# EAGLE design Hall Effect Arduino (EAGLE 7.1.0)
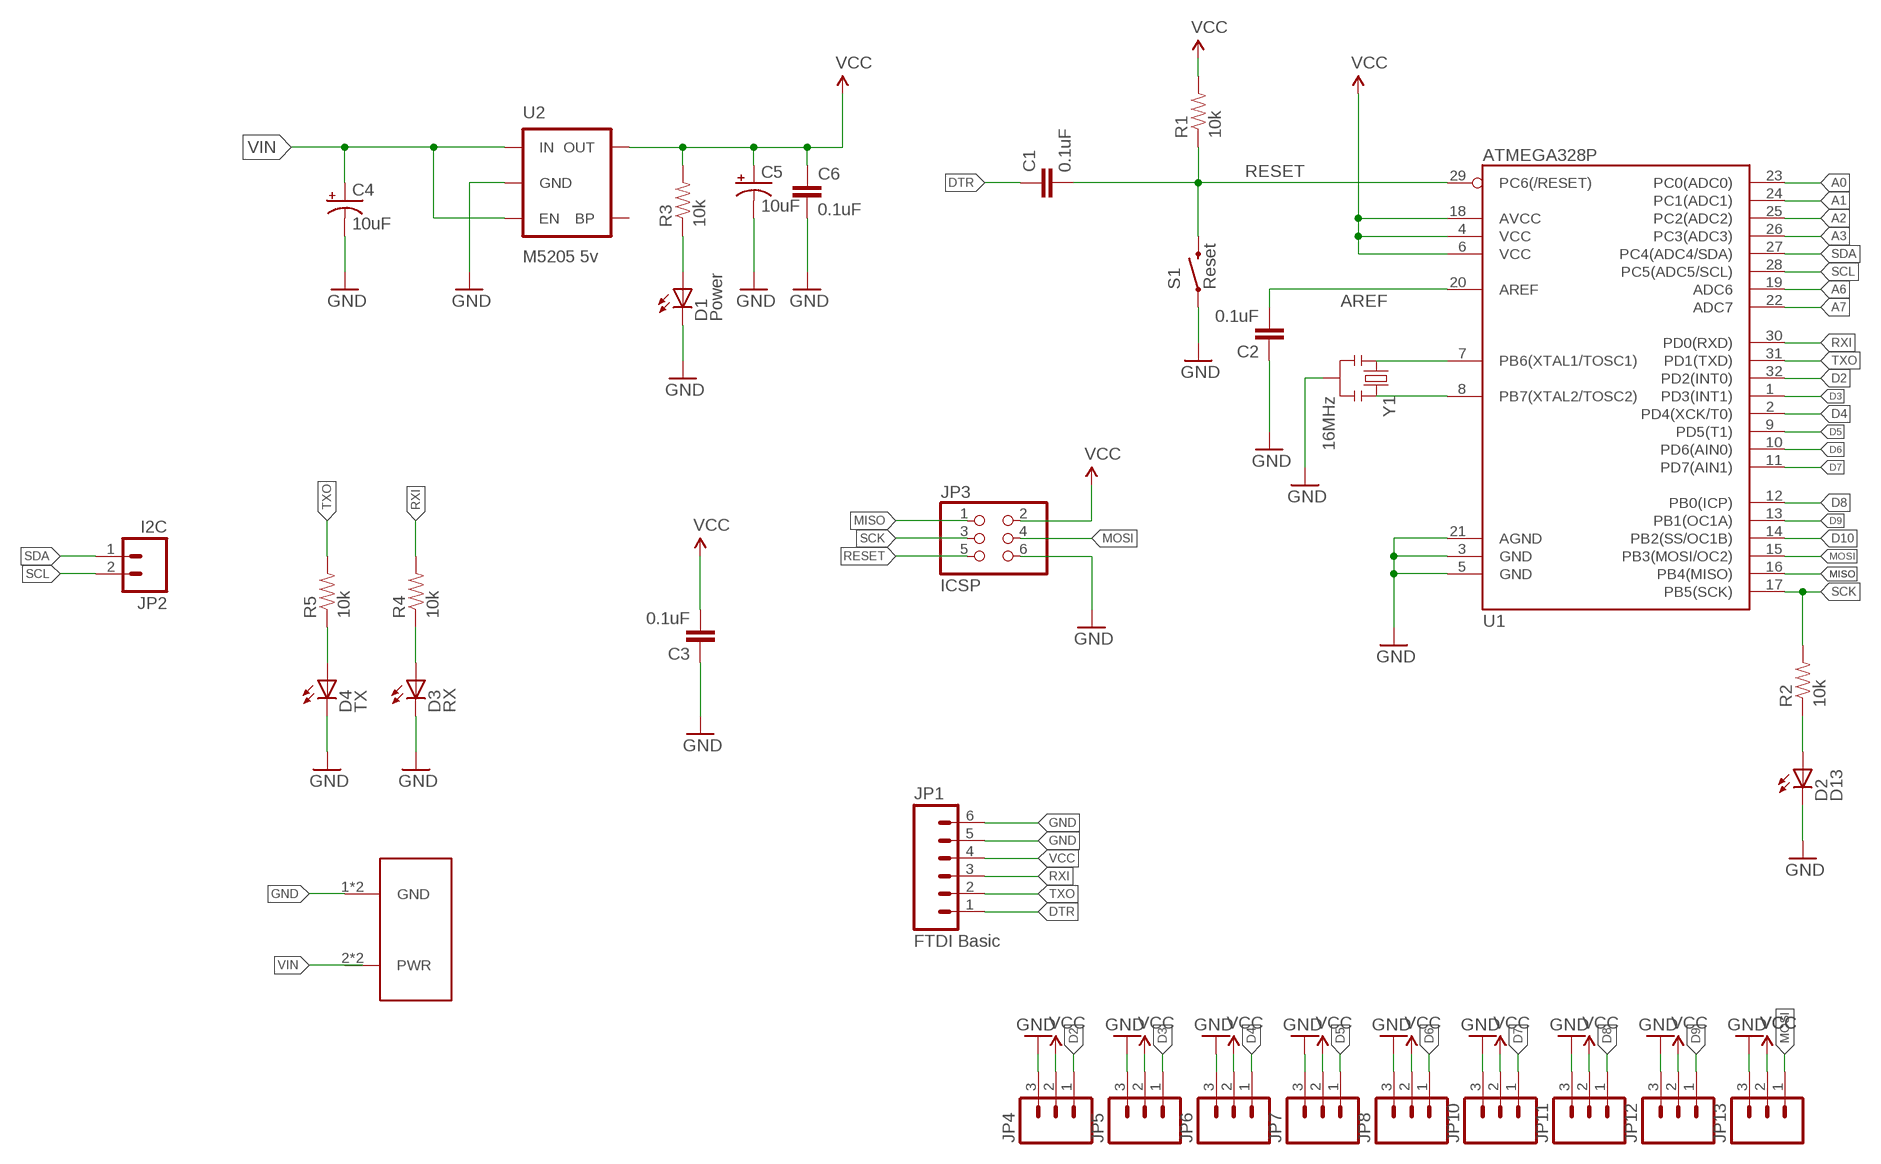
[diagram p0: schematic, sheet 1]

## Parts
C1  0.1uF  CAP0603-CAP  [0603-CAP]
C2  0.1uF  CAP0603-CAP  [0603-CAP]
C3  0.1uF  CAP0603-CAP  [0603-CAP]
C4  10uF  CAP_POL1206  [EIA3216]
C5  10uF  CAP_POL1206  [EIA3216]
C6  0.1uF  CAP0603-CAP  [0603-CAP]
D1  Power  LED-RED0603  [LED-0603]
D2  D13  LED-RED0603  [LED-0603]
D3  RX  LED-GREEN0603  [LED-0603]
D4  TX  LED-RED0603  [LED-0603]
JP1  FTDI Basic  M06SIP  [1X06]
JP2  I2C  M02PTH  [1X02]
JP3  ICSP  PINHD-2X3  [2X03]
JP4  M03PTH  [1X03]
JP5  M03PTH  [1X03]
JP6  M03PTH  [1X03]
JP7  M03PTH  [1X03]
JP8  M03PTH  [1X03]
JP10  M03PTH  [1X03]
JP11  M03PTH  [1X03]
JP12  M03PTH  [1X03]
JP13  M03PTH  [1X03]
R1  10k  RESISTOR0603-RES  [0603-RES]
R2  10k  RESISTOR0603-RES  [0603-RES]
R3  10k  RESISTOR0603-RES  [0603-RES]
R4  10k  RESISTOR0603-RES  [0603-RES]
R5  10k  RESISTOR0603-RES  [0603-RES]
S1  Reset  SWITCH-MOMENTARY-2SMD  [TACTILE_SWITCH_SMD]
U1  ATMEGA328P  ATMEGA328_SMT  [TQFP32-08]
U2  M5205 5v  MIC52055V  [SOT23-5]
U$1  LSF-SMT  [LSF-SMT]
Y1  16MHz  RESONATOR16MHZ  [RESONATOR-SMD]

## Nets
A0: U1.23(PC0(ADC0))
A1: U1.24(PC1(ADC1))
A2: U1.25(PC2(ADC2))
A3: U1.26(PC3(ADC3))
A6: U1.19(ADC6)
A7: U1.22(ADC7)
AREF: C2.2 U1.20(AREF)
D2: JP4.1 U1.32(PD2(INT0))
D3: JP5.1 U1.1(PD3(INT1))
D4: JP6.1 U1.2(PD4(XCK/T0))
D5: JP7.1 U1.9(PD5(T1))
D6: JP8.1 U1.10(PD6(AIN0))
D7: JP10.1 U1.11(PD7(AIN1))
D8: JP11.1 U1.12(PB0(ICP))
D9: JP12.1 U1.13(PB1(OC1A))
D10: U1.14(PB2(SS/OC1B))
DTR: C1.1 JP1.1
GND: C2.1 C3.1 C4.C(-) C5.C(-) C6.2 D1.C D2.C D3.C D4.C JP1.5 JP1.6 JP3.6 JP4.3 JP5.3 JP6.3 JP7.3 JP8.3 JP10.3 JP11.3 JP12.3 JP13.3 S1.1 U1.3(GND) U1.5(GND) U1.21(AGND) U2.2(GND) U$1.1(GND) U$1.1-2(GND) Y1.2
MISO: JP3.1 U1.16(PB4(MISO))
MOSI: JP3.4 JP13.1 U1.15(PB3(MOSI/OC2))
N$1: U1.7(PB6(XTAL1/TOSC1)) Y1.1
N$2: U1.8(PB7(XTAL2/TOSC2)) Y1.3
N$3: D1.A R3.1
N$4: D2.A R2.1
N$5: D3.A R4.1
N$6: D4.A R5.1
RESET: C1.2 JP3.5 R1.1 S1.3 U1.29(PC6(/RESET))
RXI: JP1.3 R4.2 U1.30(PD0(RXD))
SCK: JP3.3 R2.2 U1.17(PB5(SCK))
SCL: JP2.2 U1.28(PC5(ADC5/SCL))
SDA: JP2.1 U1.27(PC4(ADC4/SDA))
TXO: JP1.2 R5.2 U1.31(PD1(TXD))
VCC: C3.2 C5.A(+) C6.1 JP1.4 JP3.2 JP4.2 JP5.2 JP6.2 JP7.2 JP8.2 JP10.2 JP11.2 JP12.2 JP13.2 R1.2 R3.2 U1.4(VCC) U1.6(VCC) U1.18(AVCC) U2.5(OUT)
VIN: C4.A(+) U2.1(IN) U2.3(EN)
Unconnected: U2.4(BP) U$1.2(PWR) U$1.2-2(PWR)

## Library data of the parts
C1-C3 C6 = SparkFun-Passives:CAP: Capacitor Standard 0603 ceramic capacitor, and 0.1" leaded capacitor.
C4 C5 = SparkFun-Passives:CAP_POL: Capacitor Polarized These are standard SMD and PTH capacitors. Normally 10uF, 47uF, and 100uF in electrolytic and tantalum varieties. Always verify the external diameter of the through hole cap, it varies with capacity, voltage, and manufacturer. The EIA devices should be standard.
D1 D2 D4 = SparkFun-LED:LED-RED: Assorted Red LEDs LilyPad 1206- DIO-09912 1206- DIO-00809 0603- DIO-00819; PROD_ID: DIO-00819; VALUE: RED
D3 = SparkFun-LED:LED-GREEN: Various green LEDs Green LEDs used in SFE Production 0603- DIO-00821 LARGE- DIO-00862 LILYPAD- DIO-09910; PROD_ID: DIO-00821; VALUE: GREEN
JP1 = SparkFun-Connectors:M06: Header 6 Standard 6-pin 0.1" header. Use with straight break away headers (SKU : PRT-00116), right angle break away headers (PRT-00553), swiss pins (PRT-00743), machine pins (PRT-00117), and female headers (PRT-00115). Molex polarized connector foot print use with SKU : PRT-08094 with associated crimp pins and housings. NOTES ON THE VARIANTS LOCK and LOCK_LONGPADS... This footprint was designed to help hold the alignment of a through-hole component (i.e. 6-pin header) while soldering it into place. You may notice that each hole has been shifted either up or down by 0.005 of an inch from it's more standard position (which is a perfectly straight line). This slight alteration caused the pins (the squares in the middle) to touch the edges of the holes. Because they are alternating, it causes a "brace" to hold the component in place. 0.005 has proven to be the perfect amount of "off-center" position when using our standard breakaway headers. Although looks a little odd when you look at the bare footprint, once you have a header in there, the alteration is very hard to notice. Also,if you push a header all the way into place, it is covered up entirely on the bottom side. This idea of altering the position of holes to aid alignment will be further integrated into the Sparkfun Library for other footprints. It can help hold any component with 3 or more connection pins.
JP2 = SparkFun-Connectors:M02: Standard 2-pin 0.1" header. Use with - straight break away headers ( PRT-00116) - right angle break away headers (PRT-00553) - swiss pins (PRT-00743) - machine pins (PRT-00117) - female headers (PRT-00115) Molex polarized connector foot print use with: PRT-08233 with associated crimp pins and housings. 2.54_SCREWTERM for use with PRT-10571. 3.5mm Screw Terminal footprints for PRT-08084 5mm Screw Terminal footprints for use with PRT-08433
JP3 = SparkFun-Connectors:PINHD-2X3: PIN HEADER
JP4-JP8 JP10-JP13 = SparkFun-Connectors:M03: Header 3 Standard 3-pin 0.1" header. Use with straight break away headers (SKU : PRT-00116), right angle break away headers (PRT-00553), swiss pins (PRT-00743), machine pins (PRT-00117), and female headers (PRT-00115). Molex polarized connector foot print use with SKU : PRT-08232 with associated crimp pins and housings.
R1-R5 = SparkFun-Passives:RESISTOR: Resistor Basic schematic elements and footprints for 0603, 1206, and PTH resistors.
S1 = SparkFun-Electromechanical:SWITCH-MOMENTARY-2: Various NO switches- pushbuttons, reed, etc; PROD_ID: SWCH-08247
U1 = SparkFun-DigitalIC:ATMEGA328_SMT: 32-Pin Atmega328 part Commonly used on Arduino compatible boards Available in QFP and QFN packages TQFP is IC-09069 QFN is non-stock; PROD_ID: IC-09069
U2 = SparkFun-PowerIC:MIC5205: MIC5205 150mA vreg 3.3V - VREG-00822 5V - VREG-00823; PROD_ID: VREG-00823
U$1 = LSF-SMT:LSF-SMT
Y1 = SparkFun-FreqCtrl:RESONATOR: Resonator Small SMD resonator. Used, eg, on the Arduino Pro/ Pro Mini boards. 8MHz- XTAL-08895 16MHz- XTAL-08900; PROD_ID: XTAL-08900

## Board
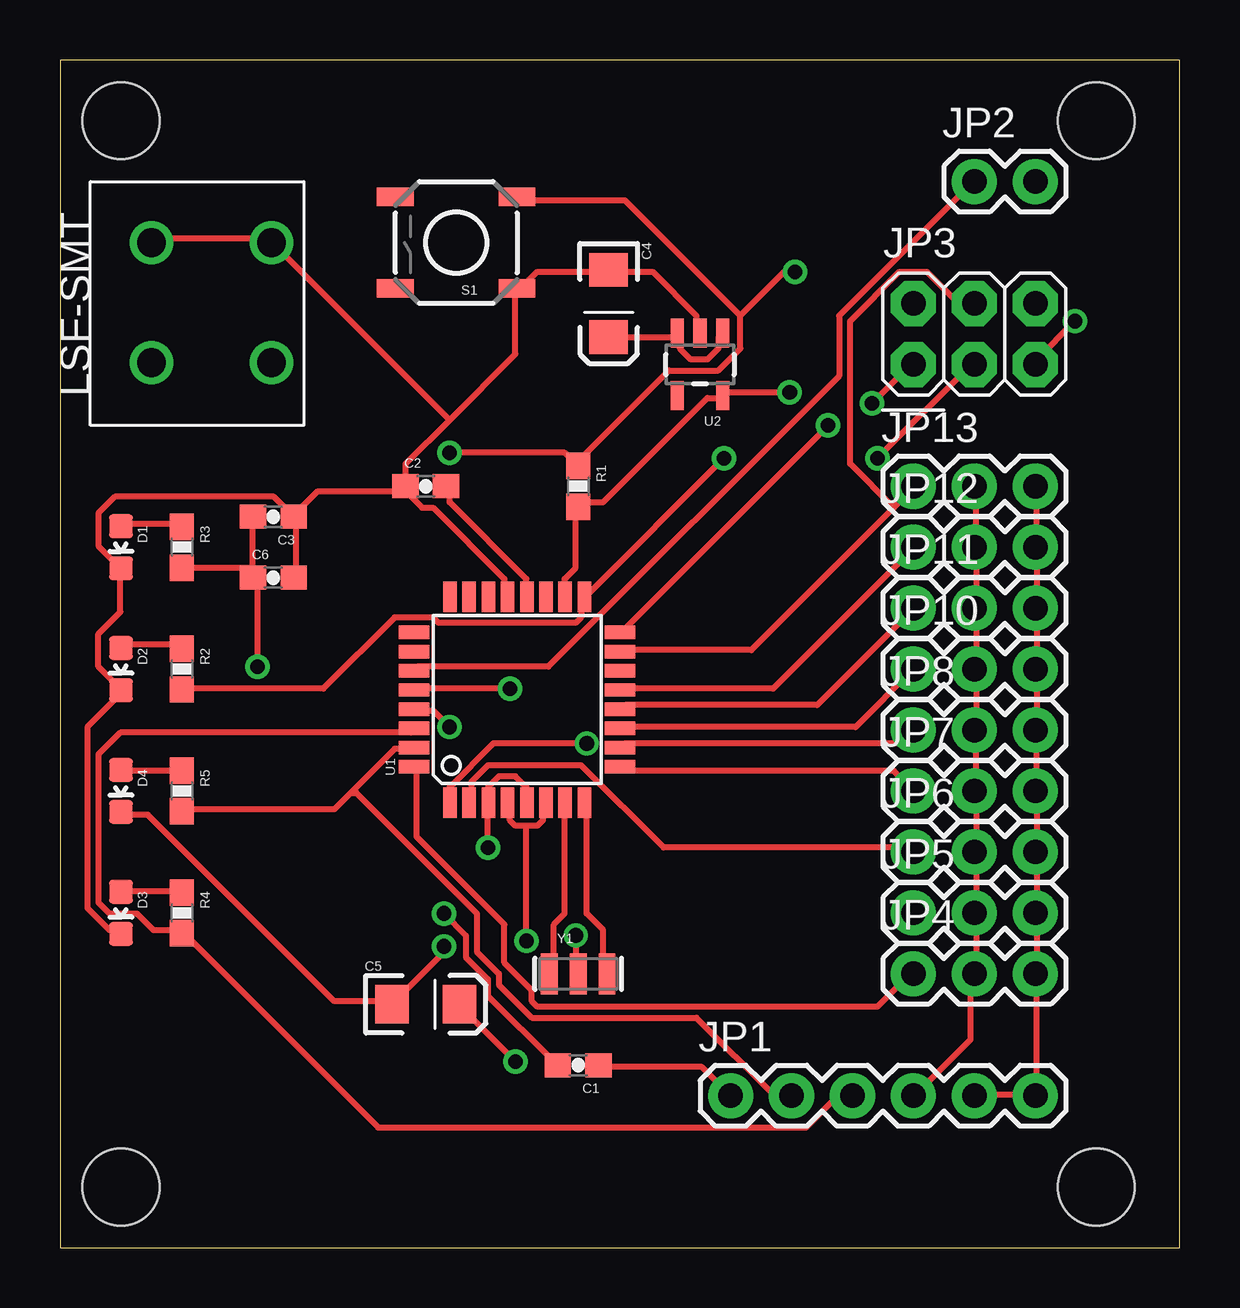
[diagram p1: board, top side]
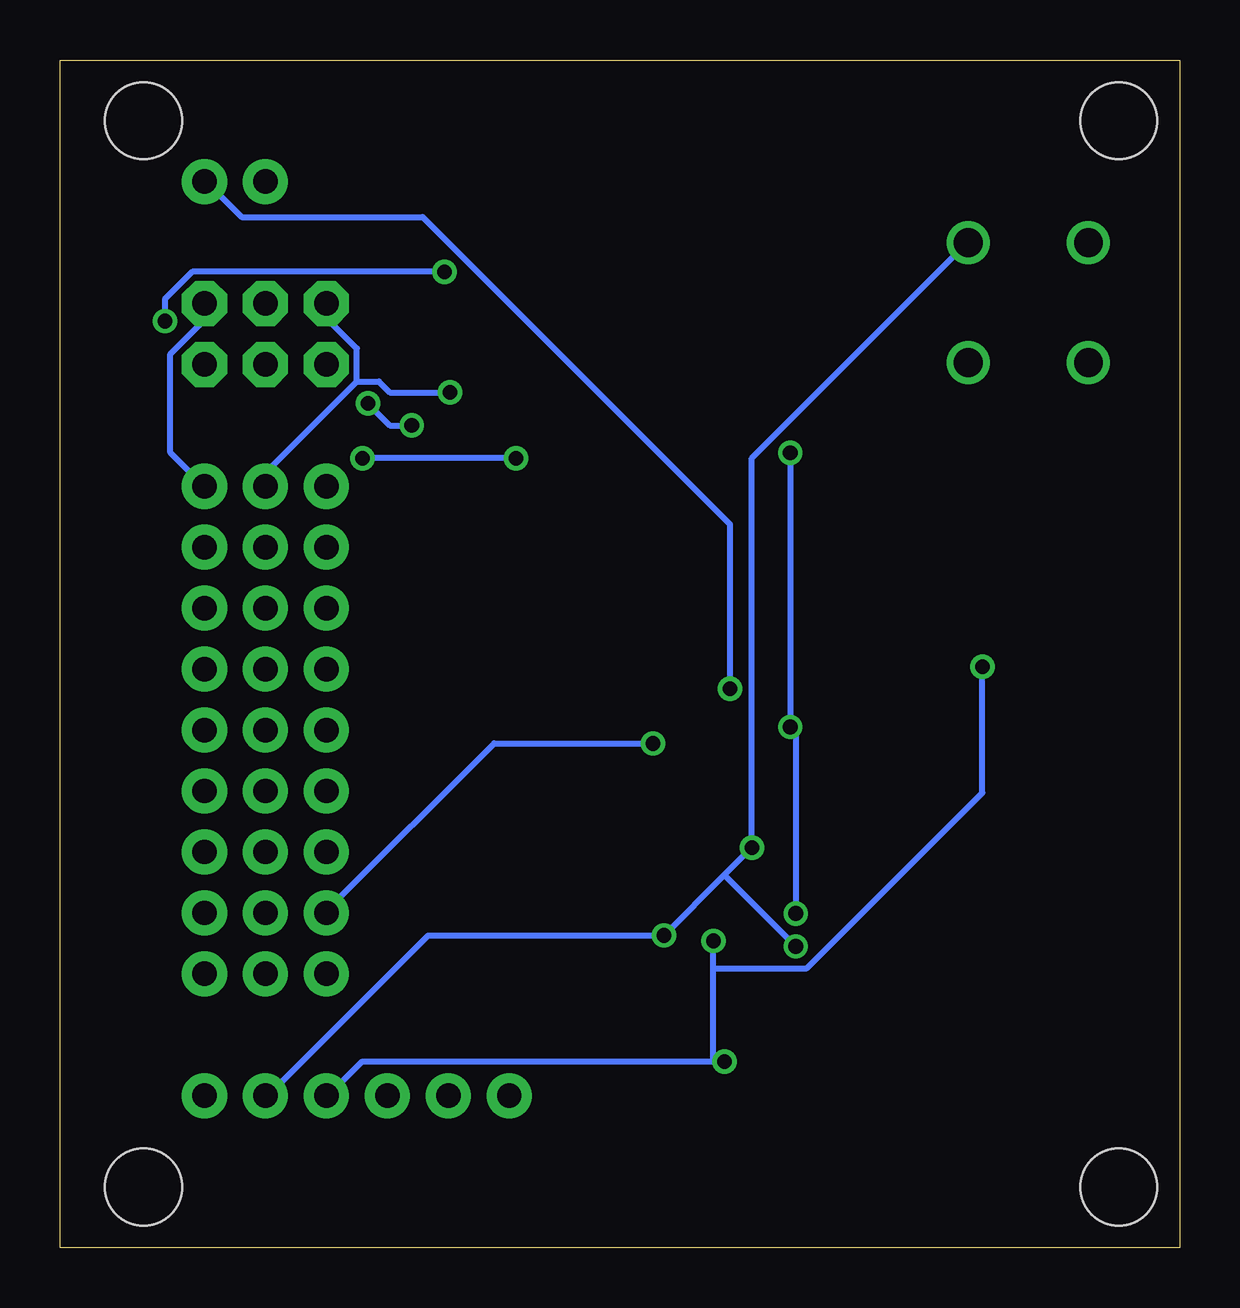
[diagram p2: board, bottom side, seen from below]

Size 46.66 x 49.52 mm. Coordinates in mm from the lower left corner, seen from the top.
Outline: 0,0 46.66,0 46.66,49.52 0,49.52 0,0
Copper layers (1*16): Top 0.035mm / dielectric 1.5mm / Bottom 0.035mm
Design rules "default": minimum track width 10mil, minimum drill 24mil, track to track 8mil, track to pad 8mil, pad to pad 8mil, via to via 8mil, smd to smd 8mil, copper to edge 40mil, drill to drill 8mil, minimum pad ring 10mil, minimum via ring 8mil, stop-mask expansion 4mil, vias tented up to drill 0mil, thermal gap 10mil
Holes 3.2 mm at 2.54,2.54 43.18,2.54 2.54,46.99 43.18,46.99

### Footprints (pad centres in the part's own frame; a part is rotated, then mirrored left to right if it is on the bottom)
0603-CAP = smd 1.1 x 1: 1 -0.85,0; 2 0.85,0
EIA3216 = smd 1.4 x 1.6: A 1.4,0; C -1.4,0
LED-0603 = smd 1 x 1: A 0,-0.877; C 0,0.877
1X06 = drill 1.016 pad 1.88: 1 0,0; 2 2.54,0; 3 5.08,0; 4 7.62,0; 5 10.16,0; 6 12.7,0
1X02 = drill 1.016 pad 1.88: 1 0,0; 2 2.54,0
2X03 = drill 1.016 pad 1.88 octagon: 1 -2.54,-1.27; 2 -2.54,1.27; 3 0,-1.27; 4 0,1.27; 5 2.54,-1.27; 6 2.54,1.27
1X03 = drill 1.016 pad 1.88: 1 0,0; 2 2.54,0; 3 5.08,0
0603-RES = smd 1.1 x 1: 1 -0.85,0; 2 0.85,0
TACTILE_SWITCH_SMD = smd 1.524 x 0.762: 1 -2.54,1.905; 2 2.54,1.905; 3 -2.54,-1.905; 4 2.54,-1.905
TQFP32-08 = smd 1.27 x 0.559: 1 -4.293,2.8; 2 -4.293,2; 3 -4.293,1.2; 4 -4.293,0.4; 5 -4.293,-0.4; 6 -4.293,-1.2; 7 -4.293,-2; 8 -4.293,-2.8; 17 4.293,-2.8; 18 4.293,-2; 19 4.293,-1.2; 20 4.293,-0.4; 21 4.293,0.4; 22 4.293,1.2; 23 4.293,2; 24 4.293,2.8 | smd 0.559 x 1.27: 9 -2.8,-4.293; 10 -2,-4.293; 11 -1.2,-4.293; 12 -0.4,-4.293; 13 0.4,-4.293; 14 1.2,-4.293; 15 2,-4.293; 16 2.8,-4.293; 25 2.8,4.293; 26 2,4.293; 27 1.2,4.293; 28 0.4,4.293; 29 -0.4,4.293; 30 -1.2,4.293; 31 -2,4.293; 32 -2.8,4.293
SOT23-5 = smd 0.55 x 1.2: 1 -0.95,-1.3; 2 0,-1.3; 3 0.95,-1.3; 4 0.95,1.3; 5 -0.95,1.3
LSF-SMT = drill 1.199: 1 0,5.004; 1-2 0,0; 2 5.004,5.004; 2-2 5.004,0
RESONATOR-SMD = smd 0.7 x 1.7: 1 -1.2,0; 2 0,0; 3 1.2,0

### Placement (x,y rotation side)
C1  21.59,7.62 180 top
C2  15.24,31.75 0 top
C3  8.89,30.48 180 top
C4  22.86,39.37 270 top
C5  15.24,10.16 0 top
C6  8.89,27.94 0 top
D1  2.54,29.21 180 top
D2  2.54,24.13 180 top
D3  2.54,13.97 180 top
D4  2.54,19.05 180 top
JP1  27.94,6.35 0 top
JP2  38.1,44.45 0 top
JP3  38.1,38.1 0 top
JP4  35.56,11.43 0 top
JP5  35.56,13.97 0 top
JP6  35.56,16.51 0 top
JP7  35.56,19.05 0 top
JP8  35.56,21.59 0 top
JP10  35.56,24.13 0 top
JP11  35.56,26.67 0 top
JP12  35.56,29.21 0 top
JP13  35.56,31.75 0 top
R1  21.59,31.75 270 top
R2  5.08,24.13 270 top
R3  5.08,29.21 270 top
R4  5.08,13.97 270 top
R5  5.08,19.05 270 top
S1  16.51,41.91 180 top
U1  19.05,22.86 90 top
U2  26.67,36.83 180 top
U$1  3.81,41.91 270 top
Y1  21.59,11.43 0 top

### Tracks (layer width: path | path; a pad name or v marks a point on that pad's centre or on a via)
AREF
  Top 0.254: C2.2 16.23,31.55 16.23,31.09 19.43,27.89 19.43,27.2 U1.20
D2
  Top 0.254: U1.32 14.86,19.89 14.86,17.14 18.52,13.49 18.52,11.89 19.66,10.74 19.66,10.29 19.89,10.06 34.06,10.06 35.43,11.43 JP4.1
D3  (via drill 0.61)
  Top 0.254: v21.95,21.03 18.06,21.03 16.23,19.2 16.23,18.75 U1.1
  Bottom 0.254: v21.95,21.03 28.57,21.03 35.43,14.17 JP5.1
D4
  Top 0.254: U1.2 17.14,18.75 17.14,19.43 17.83,20.12 21.72,20.12 25.15,16.69 35.43,16.69 JP6.1
D5
  Top 0.254: U1.9 23.55,19.89 34.75,19.89 35.43,19.2 JP7.1
D6
  Top 0.254: U1.10 23.55,21.03 34.98,21.03 35.43,21.49 JP8.1
D7
  Top 0.254: JP10.1 33.15,21.72 23.55,21.72 U1.11
D8
  Top 0.254: U1.12 23.55,22.63 31.55,22.63 35.43,26.52 JP11.1
D9
  Top 0.254: U1.13 23.55,23.32 29.72,23.32 35.43,29.03 JP12.1
DTR
  Top 0.254: JP1.1 26.75,7.54 22.63,7.54 C1.1
GND  (via drill 0.61)
  Top 0.254: D3.C 2.52,13.26 2.06,13.26 1.14,14.17 1.14,21.72 2.52,23.09 D2.C 2.52,23.32 1.6,24.23 1.6,25.6 2.52,26.52 2.52,28.12 D1.C 2.52,28.35 1.6,29.26 1.6,30.63 2.29,31.32 8.91,31.32 9.6,30.63 C3.1 | U$1.1-2 3.89,42.06 8.69,42.06 U$1.1 8.91,41.83 16.23,34.52 | C6.2 9.83,28.12 9.83,30.4 C3.1 | C2.1 14.17,31.55 10.74,31.55 9.83,30.63 C3.1 | U1.21 18.52,27.2 18.52,27.89 15.54,30.86 15.09,30.86 14.4,31.55 C2.1 | 16.23,34.52 14.4,32.69 14.4,31.77 C2.1 | 16.23,34.52 18.97,37.26 18.97,40.01 S1.1 19.2,40.01 19.89,40.69 22.86,40.69 | 40.69,11.43 40.69,13.95 JP5.3 40.69,14.17 40.69,16.46 JP6.3 40.69,16.69 40.69,18.97 JP7.3 40.69,19.2 40.69,21.49 JP8.3 40.69,21.72 40.69,24 JP10.3 40.69,24.23 40.69,26.52 JP11.3 40.69,26.75 40.69,29.03 JP12.3 40.69,29.26 40.69,31.55 JP13.3 | D4.C 2.74,18.06 3.66,18.06 11.43,10.29 13.72,10.29 C5.C 13.95,10.29 16,12.34 v16,12.57 | U1.5 19.43,18.75 19.43,19.2 18.97,19.66 18.29,19.66 17.83,19.2 17.83,18.75 U1.3 17.83,18.52 v17.83,16.69 | v21.49,13.03 21.49,11.43 Y1.2 | JP1.5 38.18,6.4 40.46,6.4 JP1.6 40.69,6.4 40.69,11.43 | 40.69,11.43 JP4.3 | 22.86,40.69 24.69,40.69 26.52,38.86 26.52,38.18 U2.2 | 22.86,40.69 C4.C
  Bottom 0.254: JP3.6 40.69,39.32 40.69,38.63 42.06,37.26 42.06,33.15 40.69,31.77 JP13.3 | JP1.5 37.95,6.4 31.32,13.03 v21.49,13.03 18.97,15.54 | 18.97,15.54 v17.83,16.69 17.83,32.92 8.91,41.83 U$1.1 | 18.97,15.54 v16,12.57
MISO  (via drill 0.61)
  Top 0.254: v32,34.29 23.55,25.83 U1.16 | v33.83,35.2 35.43,36.8 JP3.1
  Bottom 0.254: v32,34.29 32.92,34.29 v33.83,35.2
MOSI
  Top 0.254: 34.75,30.86 35.43,31.55 JP13.1 | 34.75,30.86 28.8,24.92 23.55,24.92 U1.15 | 34.75,30.86 32.92,32.69 32.92,38.63 34.98,40.69 36.12,40.69 37.26,39.55 37.95,39.55 JP3.4
N$1
  Top 0.254: U1.7 21.03,18.52 21.03,13.95 20.57,13.49 20.57,11.43 Y1.1
N$2
  Top 0.254: U1.8 21.95,18.52 21.95,13.95 22.63,13.26 22.63,11.43 Y1.3
N$3
  Top 0.254: D1.A 2.74,30.18 5.03,30.18 R3.1
N$4
  Top 0.254: D2.A 2.74,25.15 5.03,25.15 R2.1
N$5
  Top 0.254: D3.A 2.74,14.86 5.03,14.86 R4.1
N$6
  Top 0.254: D4.A 2.74,19.89 5.03,19.89 R5.1
RESET  (via drill 0.61)
  Top 0.254: v16,13.95 16.92,13.03 16.92,12.12 17.83,11.2 17.83,10.52 20.57,7.77 C1.2 | v16.23,21.72 15.54,22.4 14.86,22.4 U1.29 | v16.23,33.15 21.03,33.15 21.49,32.69 | 28.35,38.86 23.55,43.66 19.2,43.66 S1.3 | 28.35,38.86 28.35,37.49 27.43,36.58 25.38,36.58 21.49,32.69 | 21.49,32.69 R1.1 | v42.29,38.63 40.69,37.03 JP3.5 | v30.63,40.69 30.18,40.69 28.35,38.86
  Bottom 0.254: v16,13.95 16,21.49 v16.23,21.72 v16.23,33.15 | v42.29,38.63 42.29,39.55 41.15,40.69 v30.63,40.69
RXI
  Top 0.254: U1.30 14.63,21.49 2.52,21.49 1.6,20.57 1.6,14.4 2.06,13.95 3.2,13.95 3.89,13.26 5.03,13.26 R4.2 5.26,13.03 13.26,5.03 31.09,5.03 32.23,6.17 32.92,6.17 JP1.3
SCK  (via drill 0.61)
  Top 0.254: R2.2 5.26,23.32 10.97,23.32 13.95,26.29 15.54,26.29 15.77,26.06 21.49,26.06 21.72,26.29 21.72,26.98 U1.17 21.95,27.2 v27.66,32.92 | v34.06,32.92 37.95,36.8 JP3.3
  Bottom 0.254: v27.66,32.92 v34.06,32.92
SCL  (via drill 0.61)
  Top 0.254: v18.75,23.32 14.86,23.32 U1.28
  Bottom 0.254: v18.75,23.32 18.75,30.18 31.55,42.98 39.09,42.98 40.46,44.35 JP2.2
SDA
  Top 0.254: U1.27 14.86,24.23 20.34,24.23 32.46,36.35 32.46,38.86 37.95,44.35 JP2.1
TXO
  Top 0.254: 12.12,18.97 13.95,20.8 14.63,20.8 U1.31 | 12.12,18.97 11.43,18.29 5.26,18.29 R5.2 | 12.12,18.97 12.34,18.97 17.37,13.95 17.37,12.34 18.29,11.43 18.29,10.97 19.66,9.6 26.52,9.6 29.72,6.4 30.4,6.4 JP1.2
VCC  (via drill 0.61)
  Top 0.254: U1.18 21.03,27.2 21.03,27.89 21.49,28.35 21.49,30.86 R1.2 21.72,31.09 22.63,31.09 26.98,35.43 27.43,35.43 U2.5 27.66,35.66 v30.4,35.66 | JP13.2 38.18,31.55 38.18,29.26 JP12.2 38.18,29.03 38.18,26.75 JP11.2 38.18,26.52 38.18,24.23 JP10.2 38.18,24 38.18,21.72 JP8.2 38.18,21.49 38.18,19.2 JP7.2 38.18,18.97 38.18,16.69 JP6.2 38.18,16.46 38.18,14.17 JP5.2 38.18,13.95 38.18,11.43 JP4.2 37.95,11.43 37.95,8.69 35.66,6.4 JP1.4 | 8,28.35 8,30.4 C3.2 | 8,28.35 8,28.12 C6.1 | 8,28.35 5.26,28.35 R3.2 | 8,28.35 C6.1 | 19.43,17.6 19.89,17.6 20.12,17.83 20.12,18.52 U1.6 | 19.43,17.6 18.97,17.6 18.75,17.83 18.75,18.52 U1.4 | v18.97,7.77 16.69,10.06 C5.A | v19.43,12.8 19.43,17.6 | v8.23,24.23 8.23,27.89 C6.1
  Bottom 0.254: 34.29,36.12 34.29,37.49 35.43,38.63 35.43,39.32 JP3.2 | 34.29,36.12 37.95,32.46 37.95,31.77 JP13.2 | v30.4,35.66 32.92,35.66 33.38,36.12 34.29,36.12 | 19.43,7.77 34.06,7.77 35.43,6.4 JP1.4 | 19.43,7.77 19.43,11.66 | 19.43,11.66 v19.43,12.8 | 19.43,7.77 v18.97,7.77 | v8.23,24.23 8.23,18.97 15.54,11.66 19.43,11.66
VIN
  Top 0.254: U2.1 27.43,37.95 27.43,37.49 26.98,37.03 26.29,37.03 25.83,37.49 25.83,37.95 U2.3 25.6,37.95 22.86,37.95 C4.A